# EAGLE schematic SonicVisualizer (EAGLE 8.5.0)

## Sheet 1 of 2
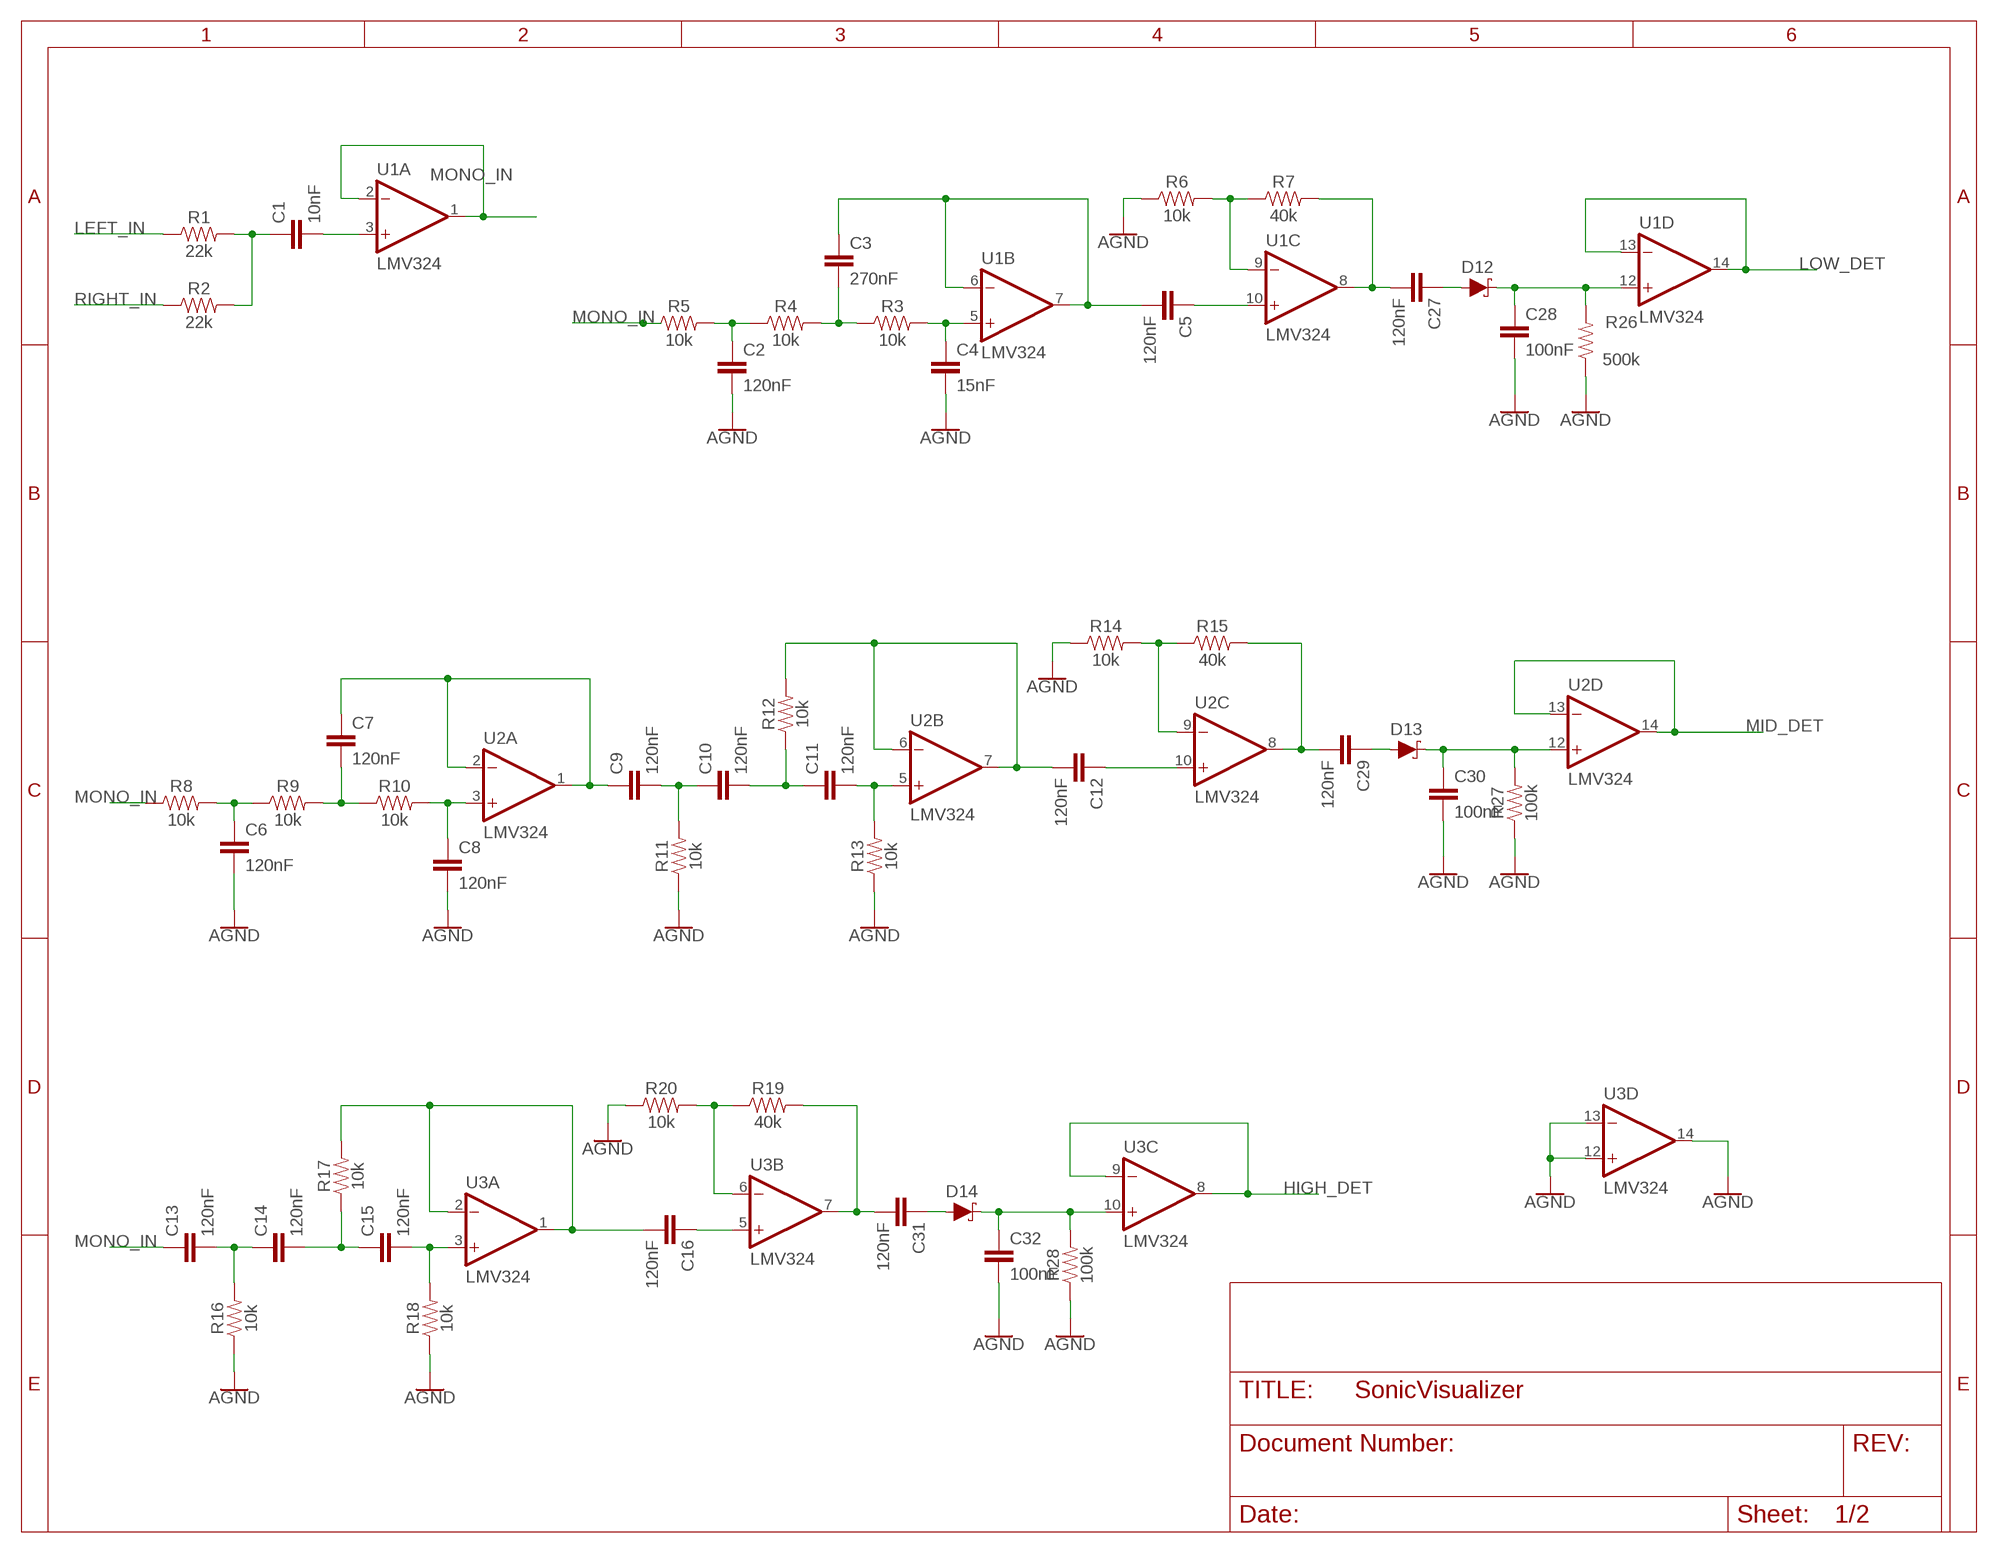
[diagram p0: schematic, sheet 1]

### Parts
C1  10nF  10NF-0603-50V-10%  [0603]
C2  120nF  0.1UF-0603-25V-(+80/-20%)  [0603]
C3  270nF  0.1UF-0603-25V-(+80/-20%)  [0603]
C4  15nF  0.1UF-0603-25V-(+80/-20%)  [0603]
C5  120nF  0.1UF-0603-25V-(+80/-20%)  [0603]
C6  120nF  0.1UF-0603-25V-(+80/-20%)  [0603]
C7  120nF  0.1UF-0603-25V-(+80/-20%)  [0603]
C8  120nF  0.1UF-0603-25V-(+80/-20%)  [0603]
C9  120nF  0.1UF-0603-25V-(+80/-20%)  [0603]
C10  120nF  0.1UF-0603-25V-(+80/-20%)  [0603]
C11  120nF  0.1UF-0603-25V-(+80/-20%)  [0603]
C12  120nF  0.1UF-0603-25V-(+80/-20%)  [0603]
C13  120nF  0.1UF-0603-25V-(+80/-20%)  [0603]
C14  120nF  0.1UF-0603-25V-(+80/-20%)  [0603]
C15  120nF  0.1UF-0603-25V-(+80/-20%)  [0603]
C16  120nF  0.1UF-0603-25V-(+80/-20%)  [0603]
C27  120nF  0.1UF-0603-25V-(+80/-20%)  [0603]
C28  100nF  0.1UF-0603-25V-(+80/-20%)  [0603]
C29  120nF  0.1UF-0603-25V-(+80/-20%)  [0603]
C30  100nF  0.1UF-0603-25V-(+80/-20%)  [0603]
C31  120nF  0.1UF-0603-25V-(+80/-20%)  [0603]
C32  100nF  0.1UF-0603-25V-(+80/-20%)  [0603]
D12  DIODE-SCHOTTKY-SS14  [SMA-DIODE]
D13  DIODE-SCHOTTKY-SS14  [SMA-DIODE]
D14  DIODE-SCHOTTKY-SS14  [SMA-DIODE]
R1  22k  22KOHM-0603-1/10W-1%  [0603]
R2  22k  22KOHM-0603-1/10W-1%  [0603]
R3  10k  10KOHM-0603-1/10W-1%  [0603]
R4  10k  10KOHM-0603-1/10W-1%  [0603]
R5  10k  10KOHM-0603-1/10W-1%  [0603]
R6  10k  10KOHM-0603-1/10W-1%  [0603]
R7  40k  10KOHM-0603-1/10W-1%  [0603]
R8  10k  10KOHM-0603-1/10W-1%  [0603]
R9  10k  10KOHM-0603-1/10W-1%  [0603]
R10  10k  10KOHM-0603-1/10W-1%  [0603]
R11  10k  10KOHM-0603-1/10W-1%  [0603]
R12  10k  10KOHM-0603-1/10W-1%  [0603]
R13  10k  10KOHM-0603-1/10W-1%  [0603]
R14  10k  10KOHM-0603-1/10W-1%  [0603]
R15  40k  10KOHM-0603-1/10W-1%  [0603]
R16  10k  10KOHM-0603-1/10W-1%  [0603]
R17  10k  10KOHM-0603-1/10W-1%  [0603]
R18  10k  10KOHM-0603-1/10W-1%  [0603]
R19  40k  10KOHM-0603-1/10W-1%  [0603]
R20  10k  10KOHM-0603-1/10W-1%  [0603]
R26  500k  10KOHM-0603-1/10W-1%  [0603]
R27  100k  10KOHM-0603-1/10W-1%  [0603]
R28  100k  10KOHM-0603-1/10W-1%  [0603]
U1  LMV324  [SO14]
U2  LMV324  [SO14]
U3  LMV324  [SO14]

### Nets
AGND: C2.2 C4.2 C6.2 C8.2 C28.2 C30.2 C32.2 R6.1 R11.1 R13.1 R14.1 R16.1 R18.1 R20.1 R26.1 R27.1 R28.1 U3.12(D:+IN) U3.13(D:-IN) U3.14(D:OUT) ; also sheet 2
HIGH_DET: U3.8(C:OUT) U3.9(C:-IN)
LEFT_IN: R1.1 ; also sheet 2
LOW_DET: U1.13(D:-IN) U1.14(D:OUT)
MID_DET: U2.13(D:-IN) U2.14(D:OUT)
MONO_IN: C13.1 R5.1 R8.1 U1.1(A:OUT) U1.2(A:-IN)
N$1: C1.1 R1.2 R2.2
N$2: C1.2 U1.3(A:+IN)
N$3: C27.1 D12.A
N$4: C4.1 R3.2 U1.5(B:+IN)
N$5: C3.2 R3.1 R4.2
N$6: C2.1 R4.1 R5.2
N$7: C3.1 C5.2 U1.6(B:-IN) U1.7(B:OUT)
N$8: C5.1 U1.10(C:+IN)
N$9: R6.2 R7.1 U1.9(C:-IN)
N$10: C27.2 R7.2 U1.8(C:OUT)
N$11: C7.1 C9.1 U2.1(A:OUT) U2.2(A:-IN)
N$12: C9.2 C10.1 R11.2
N$13: C10.2 C11.1 R12.1
N$14: C7.2 R9.2 R10.1
N$15: C8.1 R10.2 U2.3(A:+IN)
N$16: C6.1 R8.2 R9.1
N$17: C12.1 U2.10(C:+IN)
N$18: C12.2 R12.2 U2.6(B:-IN) U2.7(B:OUT)
N$19: C11.2 R13.2 U2.5(B:+IN)
N$20: R14.2 R15.1 U2.9(C:-IN)
N$21: C29.2 R15.2 U2.8(C:OUT)
N$22: C13.2 C14.1 R16.2
N$23: C14.2 C15.1 R17.1
N$24: C15.2 R18.2 U3.3(A:+IN)
N$25: C16.2 R17.2 U3.1(A:OUT) U3.2(A:-IN)
N$26: R19.1 R20.2 U3.6(B:-IN)
N$27: C16.1 U3.5(B:+IN)
N$28: C31.2 R19.2 U3.7(B:OUT)
N$30: C28.1 D12.C R26.2 U1.12(D:+IN)
N$36: C29.1 D13.A
N$37: C30.1 D13.C R27.2 U2.12(D:+IN)
N$41: C31.1 D14.A
N$42: C32.1 D14.C R28.2 U3.10(C:+IN)
RIGHT_IN: R2.1 ; also sheet 2

## Sheet 2 of 2
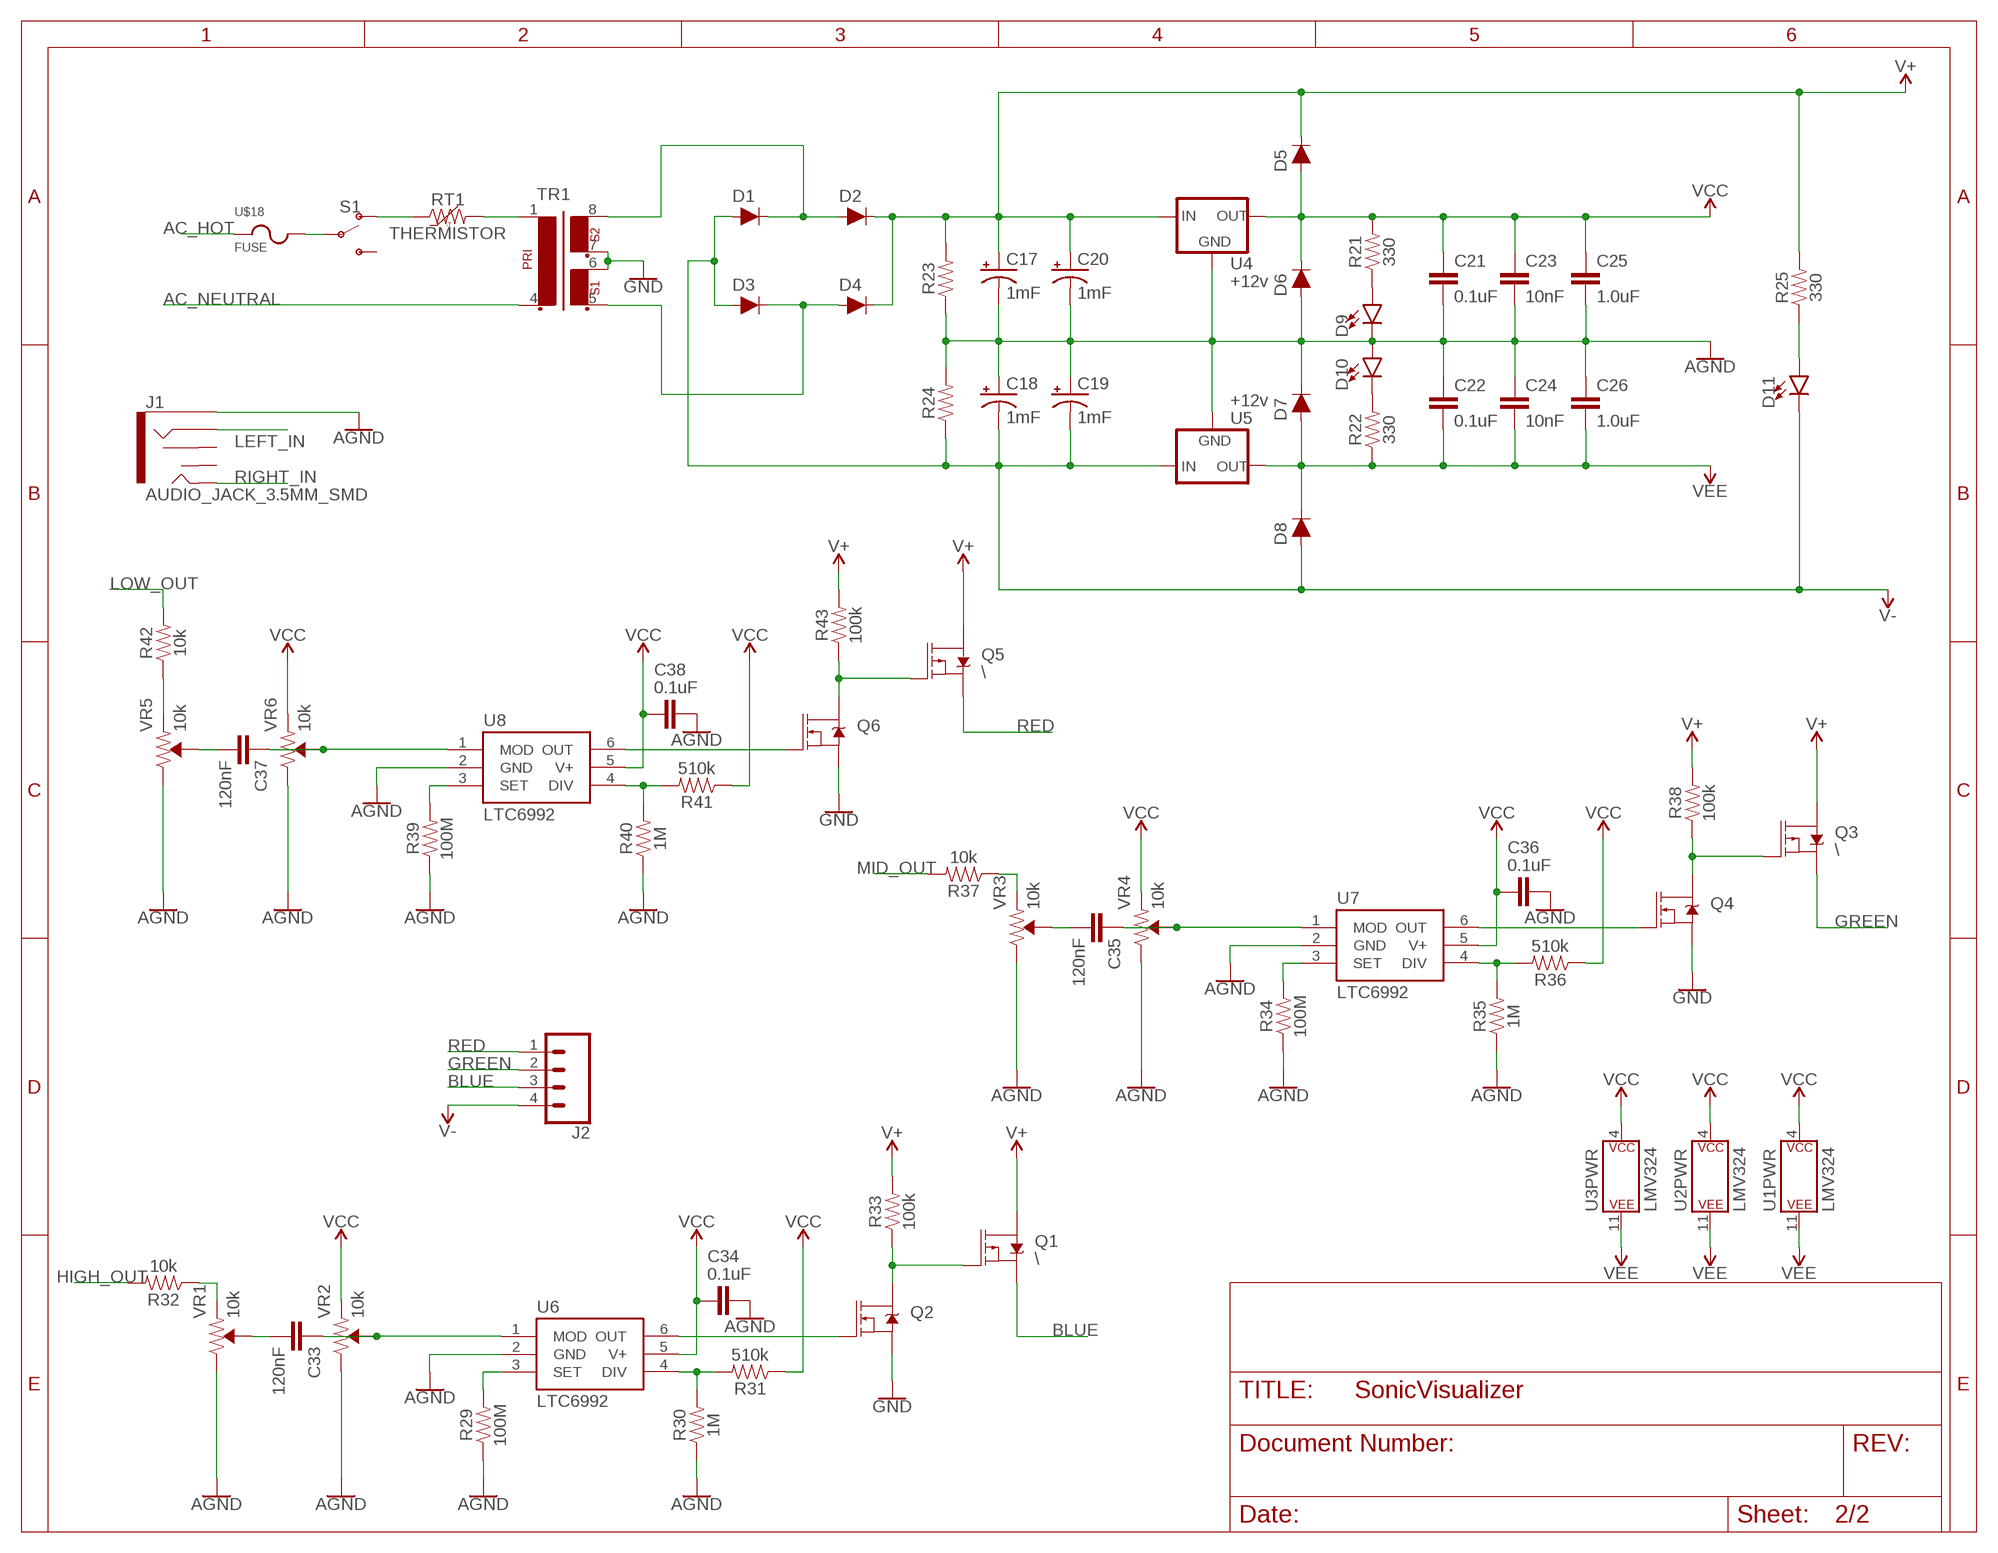
[diagram p1: schematic, sheet 2]

### Parts
C17  1mF  1000UF-RADIAL-5MM-25V-20%  [CPOL-RADIAL-5MM-10MM]
C18  1mF  1000UF-RADIAL-5MM-25V-20%  [CPOL-RADIAL-5MM-10MM]
C19  1mF  1000UF-RADIAL-5MM-25V-20%  [CPOL-RADIAL-5MM-10MM]
C20  1mF  1000UF-RADIAL-5MM-25V-20%  [CPOL-RADIAL-5MM-10MM]
C21  0.1uF  0.1UF-0603-25V-(+80/-20%)  [0603]
C22  0.1uF  0.1UF-0603-25V-(+80/-20%)  [0603]
C23  10nF  10NF-0603-50V-10%  [0603]
C24  10nF  10NF-0603-50V-10%  [0603]
C25  1.0uF  1.0UF-0603-16V-10%  [0603]
C26  1.0uF  1.0UF-0603-16V-10%  [0603]
C33  120nF  0.1UF-0603-25V-(+80/-20%)  [0603]
C34  0.1uF  0.1UF-0603-25V-(+80/-20%)  [0603]
C35  120nF  0.1UF-0603-25V-(+80/-20%)  [0603]
C36  0.1uF  0.1UF-0603-25V-(+80/-20%)  [0603]
C37  120nF  0.1UF-0603-25V-(+80/-20%)  [0603]
C38  0.1uF  0.1UF-0603-25V-(+80/-20%)  [0603]
D1  DIODE-PTH  [DIODE-1N4001]
D2  DIODE-PTH  [DIODE-1N4001]
D3  DIODE-PTH  [DIODE-1N4001]
D4  DIODE-PTH  [DIODE-1N4001]
D5  DIODE-PTH  [DIODE-1N4001]
D6  DIODE-PTH  [DIODE-1N4001]
D7  DIODE-PTH  [DIODE-1N4001]
D8  DIODE-PTH  [DIODE-1N4001]
D9  LED0603  [LED-0603]
D10  LED0603  [LED-0603]
D11  LED0603  [LED-0603]
J1  AUDIO_JACK_3.5MM_SMD  [AUDIO-JACK-3.5MM-SMD]
J2  CONN_04  [1X04]
Q1  \  MOSFET_PCH-IRLML2244  [SOT23-3]
Q2  MOSFET-NCH-2N7002PW  [SOT323]
Q3  \  MOSFET_PCH-IRLML2244  [SOT23-3]
Q4  MOSFET-NCH-2N7002PW  [SOT323]
Q5  \  MOSFET_PCH-IRLML2244  [SOT23-3]
Q6  MOSFET-NCH-2N7002PW  [SOT323]
R21  330  330OHM-0603-1/10W-1%  [0603]
R22  330  330OHM-0603-1/10W-1%  [0603]
R23  RESISTORAXIAL-0.3  [AXIAL-0.3]
R24  RESISTORAXIAL-0.3  [AXIAL-0.3]
R25  330  330OHM-0603-1/10W-1%  [0603]
R29  100M  10KOHM-0603-1/10W-1%  [0603]
R30  1M  10KOHM-0603-1/10W-1%  [0603]
R31  510k  10KOHM-0603-1/10W-1%  [0603]
R32  10k  10KOHM-0603-1/10W-1%  [0603]
R33  100k  10KOHM-0603-1/10W-1%  [0603]
R34  100M  10KOHM-0603-1/10W-1%  [0603]
R35  1M  10KOHM-0603-1/10W-1%  [0603]
R36  510k  10KOHM-0603-1/10W-1%  [0603]
R37  10k  10KOHM-0603-1/10W-1%  [0603]
R38  100k  10KOHM-0603-1/10W-1%  [0603]
R39  100M  10KOHM-0603-1/10W-1%  [0603]
R40  1M  10KOHM-0603-1/10W-1%  [0603]
R41  510k  10KOHM-0603-1/10W-1%  [0603]
R42  10k  10KOHM-0603-1/10W-1%  [0603]
R43  100k  10KOHM-0603-1/10W-1%  [0603]
RT1  THERMISTOR  [THERMISTOR]
S1  SWITCH-SPDT-PTH-11.6X4.0MM  [SWITCH_SPDT_PTH_11.6X4.0MM]
TR1  EE20-2  [EE20-2]
U4  +12v  V_REG_78XX7812  [TO-252]
U5  +12v  V_REG_78XX7812  [TO-252]
U6  LTC6992  [SOP06]
U7  LTC6992  [SOP06]
U8  LTC6992  [SOP06]
U$18  FUSE  [THERMISTOR]
VR1  10k  TRIMPOT-SMD-3MM-CLOSED-1/8W-20%  [TRIMPOT-SMD-3MM-CLOSED]
VR2  10k  TRIMPOT-SMD-3MM-CLOSED-1/8W-20%  [TRIMPOT-SMD-3MM-CLOSED]
VR3  10k  TRIMPOT-SMD-3MM-CLOSED-1/8W-20%  [TRIMPOT-SMD-3MM-CLOSED]
VR4  10k  TRIMPOT-SMD-3MM-CLOSED-1/8W-20%  [TRIMPOT-SMD-3MM-CLOSED]
VR5  10k  TRIMPOT-SMD-3MM-CLOSED-1/8W-20%  [TRIMPOT-SMD-3MM-CLOSED]
VR6  10k  TRIMPOT-SMD-3MM-CLOSED-1/8W-20%  [TRIMPOT-SMD-3MM-CLOSED]

### Nets
AC_HOT: U$18.1
AC_NEUTRAL: TR1.4
AGND: C17.- C18.+ C19.+ C20.- C21.2 C22.1 C23.2 C24.1 C25.2 C26.1 C34.2 C36.2 C38.2 D6.A D7.C D9.C D10.A J1.SLEEVE R23.P$1 R24.P$2 R29.1 R30.1 R34.1 R35.1 R39.1 R40.1 U4.3(GND) U5.3(GND) U6.2(GND) U7.2(GND) U8.2(GND) VR1.3(CW) VR2.3(CW) VR3.3(CW) VR4.3(CW) VR5.3(CW) VR6.3(CW) ; also sheet 1
BLUE: J2.3 Q1.2(S)
GND: Q2.2(S) Q4.2(S) Q6.2(S) TR1.6 TR1.7
GREEN: J2.2 Q3.2(S)
HIGH_OUT: R32.2
LEFT_IN: J1.RING ; also sheet 1
LOW_OUT: R42.2
MID_OUT: R37.2
N$29: D1.C D2.A TR1.8
N$31: R29.2 U6.3(SET)
N$32: D3.C D4.A TR1.5
N$33: D9.A R21.1
N$34: R30.2 R31.2 U6.4(DIV)
N$35: D10.C R22.2
N$38: C33.2 VR1.2(WIPER)
N$39: D11.A R25.1
N$40: Q2.1(G) U6.6(OUT)
N$43: R32.1 VR1.1(CCW)
N$44: C33.1 U6.1(MOD) VR2.2(WIPER)
N$46: Q1.1(G) Q2.3(D) R33.1
N$47: RT1.2 TR1.1
N$48: S1.2(P) U$18.2
N$49: RT1.1 S1.1(O)
N$50: R34.2 U7.3(SET)
N$51: R35.2 R36.2 U7.4(DIV)
N$52: C35.1 U7.1(MOD) VR4.2(WIPER)
N$53: C35.2 VR3.2(WIPER)
N$54: R37.1 VR3.1(CCW)
N$56: Q4.1(G) U7.6(OUT)
N$57: Q3.1(G) Q4.3(D) R38.1
N$58: R39.2 U8.3(SET)
N$59: R40.2 R41.2 U8.4(DIV)
N$60: C37.1 U8.1(MOD) VR6.2(WIPER)
N$61: C37.2 VR5.2(WIPER)
N$62: R42.1 VR5.1(CCW)
N$64: Q6.1(G) U8.6(OUT)
N$65: Q5.1(G) Q6.3(D) R43.1
RED: J2.1 Q5.2(S)
RIGHT_IN: J1.TIP ; also sheet 1
V+: C17.+ C20.+ D2.C D4.C D5.C Q1.3(D) Q3.3(D) Q5.3(D) R23.P$2 R25.2 R33.2 R38.2 R43.2 U4.1(IN)
V-: C18.- C19.- D1.A D3.A D8.A D11.C J2.4 R24.P$1 U5.1(IN)
VCC: C21.1 C23.1 C25.1 C34.1 C36.1 C38.1 D5.A D6.C R21.2 R31.1 R36.1 R41.1 U1.4(PWR:P$V+) U2.4(PWR:P$V+) U3.4(PWR:P$V+) U4.2(OUT) U6.5(V+) U7.5(V+) U8.5(V+) VR2.1(CCW) VR4.1(CCW) VR6.1(CCW)
VEE: C22.2 C24.2 C26.2 D7.A D8.C R22.1 U1.11(PWR:P$V-) U2.11(PWR:P$V-) U3.11(PWR:P$V-) U5.2(OUT)
Unconnected: J1.RSH J1.TSH S1.3(S)

## Library data of the parts
C1 C23 C24 = SparkFun-Capacitors:10NF: 0.01uF/10nF/10,000pF ceramic capacitors A capacitor is a passive two-terminal electrical component used to store electrical energy temporarily in an electric field. CAP-09321; PROD_ID: CAP-00867
C2-C16 C27-C33 C35 C37 = SparkFun-Capacitors:0.1UF: 0.1µF ceramic capacitors A capacitor is a passive two-terminal electrical component used to store electrical energy temporarily in an electric field.; PROD_ID: CAP-00810; VALUE: 0.1uF
C17-C20 = SparkFun-Capacitors:1000UF: 1,000µF/1mF ceramic capacitors A capacitor is a passive two-terminal electrical component used to store electrical energy temporarily in an electric field. CAP-08070; PROD_ID: CAP-09538
C21 C22 C34 C36 C38 = SparkFun-Capacitors:0.1UF: 0.1µF ceramic capacitors A capacitor is a passive two-terminal electrical component used to store electrical energy temporarily in an electric field.; PROD_ID: CAP-00810
C25 C26 = SparkFun-Capacitors:1.0UF: 1µF ceramic capacitors A capacitor is a passive two-terminal electrical component used to store electrical energy temporarily in an electric field.; PROD_ID: CAP-00868
D1-D8 = SparkFun-DiscreteSemi:DIODE: Diode These are standard reverse protection diodes and small signal diodes. SparkFun Products: SparkFun SparkPunk Sound Kit <https://www.sparkfun.com/products/11177> SparkFun ESP8266 Thing <https://www.sparkfun.com/products/13231>; PROD_ID: DIO-09176; VALUE: 1A/50V/1.1V
D9-D11 = SparkFun-LED:LED: LED (Generic) Standard schematic elements and footprints for 5mm, 3mm, 1206, and 0603 sized LEDs. Generic LEDs with no color specified.
D12-D14 = SparkFun-DiscreteSemi:DIODE-SCHOTTKY: Schottky diode A Schottky diode is a semiconductor diode which has a low forward voltage drop and a very fast switching action.; PROD_ID: DIO-08053; VALUE: 1A/40V/500mV
J1 = SparkFun-Connectors:AUDIO_JACK_3.5MM: Audio Jack 3.5mm variants of PTH and SMT stereo audio jack with bypass switches. SparkFun Products: SparkFun SparkPunk Sound Kit <[https://www.sparkfun.com/products/11177]> - PTH MP3 Trigger <https://www.sparkfun.com/products/13720> -3.5mm SMD SparkFun PicoBoard <https://www.sparkfun.com/products/11888>- 2.5mm SMD; PROD_ID: CONN-10353
J2 = SparkFun-Connectors:CONN_04: Multi connection point. Often used as Generic Header-pin footprint for 0.1 inch spaced/style header connections On any of the 0.1 inch spaced packages, you can populate with these: Break Away Headers - Straight <https://www.sparkfun.com/products/116> (PRT-00116) Break Away Male Headers - Right Angle <https://www.sparkfun.com/products/553> (PRT-00553) Female Headers <https://www.sparkfun.com/products/115> (PRT-00115) Break Away Headers - Machine Pin <https://www.sparkfun.com/products/117> (PRT-00117) Break Away Female Headers - Swiss Machine Pin <https://www.sparkfun.com/products/743> (PRT-00743) For SCREWTERMINALS and SPRING TERMINALS visit here: Screw Terimnals on SparkFun.com <https://www.sparkfun.com/search/results?term=Screw+Terminals> (5mm/3.5mm/2.54mm spacing) This device is also useful as a general connection point to wire up your design to another part of your project. Our various solder wires solder well into these plated through hole pads. Hook-Up Wire - Assortment (Stranded, 22 AWG) <https://www.sparkfun.com/products/11375> (PRT-11375) Hook-Up Wire - Assortment (Solid Core, 22 AWG) <https://www.sparkfun.com/products/11367> (PRT-11367) View the entire wire category on our website here <https://www.sparkfun.com/categories/141> Special notes: Molex polarized connector foot print use with SKU : PRT-08231 with associated crimp pins and housings. 1MM SMD Version SKU: PRT-10208; PROD_ID: CONN-09696
Q1 Q3 Q5 = SparkFun-DiscreteSemi:MOSFET_PCH: P-channel MOSFETs Voltage controlled devices that allow control of high current outputs. SparkFun Products: SparkFun ESP32 Thing <https://www.sparkfun.com/products/13907> SparkFun ESP8266 Thing <https://www.sparkfun.com/products/13231>; PROD_ID: TRANS-11153; VALUE: 4.3A/20V/54mΩ
Q2 Q4 Q6 = SparkFun-DiscreteSemi:MOSFET-NCH: N-channel MOSFETs Voltage controlled devices that allow control of high current outputs. SparkFun Products: SparkFun OpenScale <https://www.sparkfun.com/products/13261> SparkFun Digital Sandbox <https://www.sparkfun.com/products/12651> SparkFun Monster Moto Shield <https://www.sparkfun.com/products/10182> SparkFun MOSFET Power Controller <https://www.sparkfun.com/products/11214>; PROD_ID: TRANS-11151; VALUE: 310mA/60V/1.6Ω
R1 R2 = SparkFun-Resistors:22KOHM: 22kΩ resistor A resistor is a passive two-terminal electrical component that implements electrical resistance as a circuit element. Resistors act to reduce current flow, and, at the same time, act to lower voltage levels within circuits. - Wikipedia; PROD_ID: RES-07853
R3-R6 R8-R14 R16-R18 R20 R32 R37 R42 = SparkFun-Resistors:10KOHM: 10kΩ resistor A resistor is a passive two-terminal electrical component that implements electrical resistance as a circuit element. Resistors act to reduce current flow, and, at the same time, act to lower voltage levels within circuits. - Wikipedia; PROD_ID: RES-00824
R7 R15 R19 R26-R31 R33-R36 R38-R41 R43 = SparkFun-Resistors:10KOHM: 10kΩ resistor A resistor is a passive two-terminal electrical component that implements electrical resistance as a circuit element. Resistors act to reduce current flow, and, at the same time, act to lower voltage levels within circuits. - Wikipedia; PROD_ID: RES-00824; VALUE: 10k
R21 R22 R25 = SparkFun-Resistors:330OHM: 330Ω resistor A resistor is a passive two-terminal electrical component that implements electrical resistance as a circuit element. Resistors act to reduce current flow, and, at the same time, act to lower voltage levels within circuits. - Wikipedia; PROD_ID: RES-00818
R23 R24 = SparkFun-Resistors:RESISTOR: Generic Resistor Package
RT1 = SonicVisualizer:THERMISTOR
S1 = SparkFun-Switches:SWITCH-SPDT: Single Pole, Double Throw (SPDT) Switch Single-pole, double-throw (SPDT) switch. Variant Overview SMD-AYZ0202 Surface Mount DPDT Switch <https://www.sparkfun.com/products/597> (COM-00597) Used on e.g. LilyPad Arduino USB - ATmega32U4 Board <https://www.sparkfun.com/products/12049> PTH-11.6X4.0MM SPDT Mini Power Switch <https://www.sparkfun.com/products/102> (COM-00102) Used on e.g. SparkFun Simon Says - Through-Hole Soldering Kit <https://www.sparkfun.com/products/10547> (KIT-10547) PTH-11.6X4.0MM-KIT KIT version of SPDT Mini Power Switch - Simplifies soldering by removing tStop of switch pins - only one side can be soldered. PTH-11.6X4.0MM-LOCK LOCK version of SPDT Mini Power Switch - Offset pins hold switch in place for easier soldering. SMD-RIGHT-ANGLE Surface Mount Right Angle Switch <https://www.sparkfun.com/products/10860> (COM-10860) Used on e.g. SparkFun ESP8266 Thing <https://www.sparkfun.com/products/13231>; PROD_ID: SWCH-08261; SF_SKU: COM-00102
TR1 = trafo:EE20-2: TRANSFORMER 1 primary winding, 2 secondary windings ERA
U1-U3 = SonicVisualizer:LMV324
U4 U5 = SparkFun-IC-Power:V_REG_78XX: Voltage Regulator Standard 78xx regulator. IGO (Input Ground Output). Spark Fun Electronics SKU : COM-00107; PROD_ID: VREG-12370
U6-U8 = SonicVisualizer:LTC6992
U$18 = SonicVisualizer:FUSE
VR1-VR6 = SparkFun-Resistors:TRIMPOT: Trimming Potentiometer (Trimpot) Three-terminal potentiometers, with an adjustable wiper and two adjustable resistors. A pot can be used to create a configurable voltage divider, or as a variable resistor. "Trimpots" are a subset of potentiometers, usually intended for "set-and-forget" applications. They're often more delicate than standard potentiometers - rated for fewer turns. Variants PTH-KNOB - PTH Trimpot w/ finger-adjustable knob Trimpot 10K with Knob <https://www.sparkfun.com/products/9806> (COM-09806) Datasheet <http://www.sparkfun.com/datasheets/Components/General/TSR-3386.pdf> SMD-3MM-CLOSED-FRAME - SMD 3mm Square Closed-Frame Trimpot Used on e.g. EasyDriver - Stepper Motor Driver <https://www.sparkfun.com/products/12779> Datasheet <http://www.bitechnologies.com/pdfs/22.pdf> (22AR10KTR) SMD-5MM - SMD 5mm Square Closed-Frame Trimpot Used on e.g. IOIO-OTG - V2.2 <https://www.sparkfun.com/products/13613> Datasheet <http://www.vishay.com/docs/51008/ts53.pdf> (TS53YL502MR10) SMD-3MM-1/10W-25% - 3mm Square Open-Frame Trimpot Used on e.g. SparkFun Shapeoko <https://www.sparkfun.com/products/13899> Datasheet <http://www.bourns.com/docs/Product-Datasheets/TC33.pdf> (TC33X-2-103E); PROD_ID: RES-09285